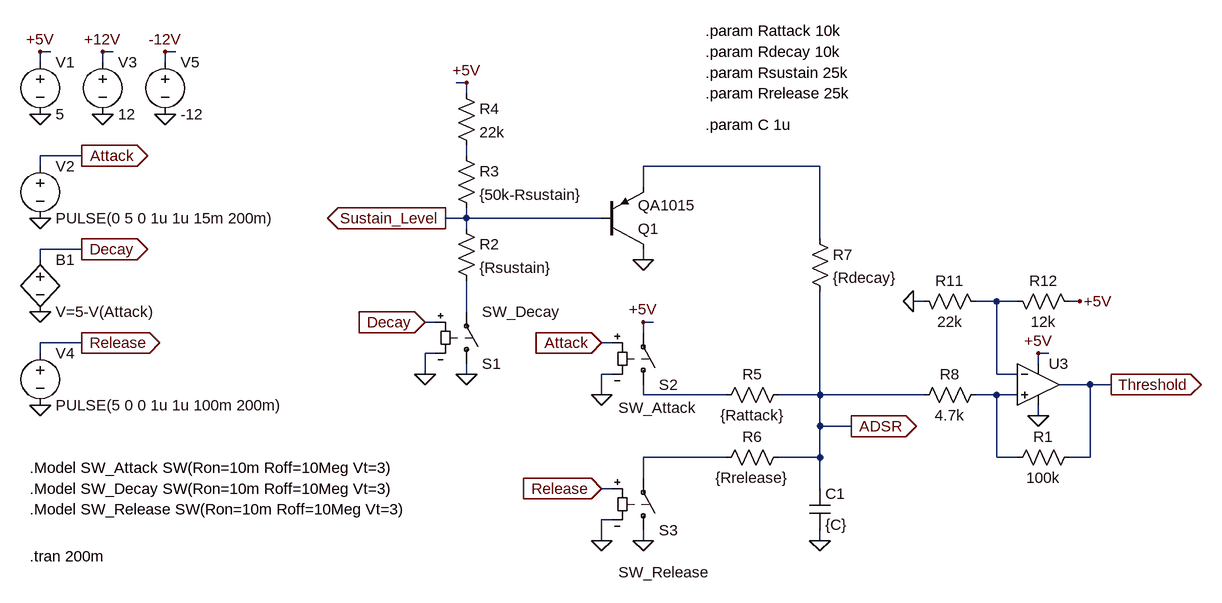
[diagram p0: schematic ADSR_SW+NonInv_Hys_Comparator.asc]
ADSR_SW+NonInv_Hys_Comparator.asc, the LTspice schematic file:
Version 4
SHEET 1 1660 760
WIRE -384 -336 -400 -336
WIRE -288 -336 -304 -336
WIRE -192 -336 -208 -336
WIRE -400 -320 -400 -336
WIRE -304 -320 -304 -336
WIRE -208 -320 -208 -336
WIRE 256 -288 240 -288
WIRE 256 -272 256 -288
WIRE -336 -176 -400 -176
WIRE 256 -176 256 -192
WIRE -400 -160 -400 -176
WIRE 800 -160 528 -160
WIRE 528 -128 528 -160
WIRE 256 -80 256 -96
WIRE 256 -80 224 -80
WIRE 464 -80 256 -80
WIRE 256 -64 256 -80
WIRE 800 -48 800 -160
WIRE -336 -32 -400 -32
WIRE -400 -16 -400 -32
WIRE 528 -16 528 -32
WIRE 960 48 944 48
WIRE 1072 48 1040 48
WIRE 1104 48 1072 48
WIRE 1200 48 1184 48
WIRE 256 64 256 16
WIRE 208 80 192 80
WIRE 544 80 528 80
WIRE 528 96 528 80
WIRE -336 112 -400 112
WIRE 480 112 464 112
WIRE -400 128 -400 112
WIRE 208 128 192 128
WIRE 1152 128 1136 128
WIRE 1136 144 1136 128
WIRE 192 160 192 128
WIRE 256 160 256 144
WIRE 480 160 464 160
WIRE 1072 160 1072 48
WIRE 1104 160 1072 160
WIRE 1216 176 1168 176
WIRE 1248 176 1216 176
WIRE 464 192 464 160
WIRE 528 192 528 176
WIRE 656 192 528 192
WIRE 800 192 800 32
WIRE 800 192 736 192
WIRE 960 192 800 192
WIRE 1072 192 1040 192
WIRE 1104 192 1072 192
WIRE 1136 224 1136 208
WIRE 800 240 800 192
WIRE 848 240 800 240
WIRE 656 288 528 288
WIRE 800 288 800 240
WIRE 800 288 736 288
WIRE 1072 288 1072 192
WIRE 1104 288 1072 288
WIRE 1216 288 1216 176
WIRE 1216 288 1184 288
WIRE 528 320 528 288
WIRE 480 336 464 336
WIRE 800 336 800 288
WIRE 480 384 464 384
WIRE 464 416 464 384
WIRE 528 416 528 400
WIRE 800 416 800 400
FLAG 192 80 Decay
IOPIN 192 80 In
FLAG 256 -288 +5V
FLAG 256 160 0
FLAG 528 -16 0
FLAG 464 112 Attack
IOPIN 464 112 In
FLAG 464 336 Release
IOPIN 464 336 In
FLAG 800 416 0
FLAG 1248 176 Threshold
IOPIN 1248 176 Out
FLAG -400 -336 +5V
FLAG -400 -240 0
FLAG -336 -176 Attack
IOPIN -336 -176 Out
FLAG -400 -80 0
FLAG -336 -32 Decay
IOPIN -336 -32 Out
FLAG -336 112 Release
IOPIN -336 112 Out
FLAG -400 208 0
FLAG -400 64 0
FLAG 224 -80 Sustain_Level
IOPIN 224 -80 Out
FLAG 192 160 0
FLAG 528 416 0
FLAG 464 416 0
FLAG 464 192 0
FLAG 528 80 +5V
FLAG -304 -240 0
FLAG -208 -240 0
FLAG -304 -336 +12V
FLAG -208 -336 -12V
FLAG 1136 224 0
FLAG 1200 48 +5V
FLAG 944 48 0
FLAG 1136 128 +5V
FLAG 848 240 ADSR
IOPIN 848 240 Out
SYMBOL res 240 -80 R0
SYMATTR InstName R2
SYMATTR Value {Rsustain}
SYMBOL res 240 -192 R0
SYMATTR InstName R3
SYMATTR Value {50k-Rsustain}
SYMBOL res 240 -288 R0
SYMATTR InstName R4
SYMATTR Value 22k
SYMBOL res 752 176 R90
WINDOW 0 0 56 VBottom 2
WINDOW 3 32 56 VTop 2
SYMATTR InstName R5
SYMATTR Value {Rattack}
SYMBOL res 752 272 R90
WINDOW 0 0 56 VBottom 2
WINDOW 3 32 56 VTop 2
SYMATTR InstName R6
SYMATTR Value {Rrelease}
SYMBOL res 784 -64 R0
SYMATTR InstName R7
SYMATTR Value {Rdecay}
SYMBOL cap 784 336 R0
SYMATTR InstName C1
SYMATTR Value {C}
SYMBOL voltage -400 -336 R0
WINDOW 123 0 0 Left 0
WINDOW 39 0 0 Left 0
SYMATTR InstName V1
SYMATTR Value 5
SYMBOL voltage -400 -176 R0
WINDOW 123 0 0 Left 0
WINDOW 39 0 0 Left 0
SYMATTR InstName V2
SYMATTR Value PULSE(0 5 0 1u 1u 15m 200m)
SYMBOL voltage -400 112 R0
WINDOW 123 0 0 Left 0
WINDOW 39 0 0 Left 0
SYMATTR InstName V4
SYMATTR Value PULSE(5 0 0 1u 1u 100m 200m)
SYMBOL pnp 464 -32 M180
SYMATTR InstName Q1
SYMATTR Value QA1015
SYMBOL bv -400 -32 R0
SYMATTR InstName B1
SYMATTR Value V=5-V(Attack)
SYMBOL sw 256 160 M180
SYMATTR InstName S1
SYMATTR Value SW_Decay
SYMBOL sw 528 192 M180
WINDOW 3 -38 -20 Left 2
SYMATTR Value SW_Attack
SYMATTR InstName S2
SYMBOL sw 528 416 M180
WINDOW 3 -38 -49 Left 2
SYMATTR Value SW_Release
SYMATTR InstName S3
SYMBOL voltage -304 -336 R0
WINDOW 123 0 0 Left 0
WINDOW 39 0 0 Left 0
SYMATTR InstName V3
SYMATTR Value 12
SYMBOL voltage -208 -336 R0
WINDOW 123 0 0 Left 0
WINDOW 39 0 0 Left 0
SYMATTR InstName V5
SYMATTR Value -12
SYMBOL Opamps\\UniversalOpamp2 1136 176 R0
SYMATTR InstName U3
SYMBOL res 944 32 M90
WINDOW 0 0 56 VBottom 2
WINDOW 3 32 56 VTop 2
SYMATTR InstName R11
SYMATTR Value 22k
SYMBOL res 1088 32 M90
WINDOW 0 0 56 VBottom 2
WINDOW 3 32 56 VTop 2
SYMATTR InstName R12
SYMATTR Value 12k
SYMBOL res 1200 272 R90
WINDOW 0 0 56 VBottom 2
WINDOW 3 32 56 VTop 2
SYMATTR InstName R1
SYMATTR Value 100k
SYMBOL res 1056 176 R90
WINDOW 0 0 56 VBottom 2
WINDOW 3 32 56 VTop 2
SYMATTR InstName R8
SYMATTR Value 4.7k
TEXT 624 -368 Left 2 !.param Rattack 10k
TEXT 624 -336 Left 2 !.param Rdecay 10k
TEXT 624 -304 Left 2 !.param Rsustain 25k
TEXT 624 -272 Left 2 !.param Rrelease 25k
TEXT -416 440 Left 2 !.tran 200m
TEXT 624 -224 Left 2 !.param C 1u
TEXT -416 304 Left 2 !.Model SW_Attack SW(Ron=10m Roff=10Meg Vt=3)
TEXT -416 336 Left 2 !.Model SW_Decay SW(Ron=10m Roff=10Meg Vt=3)
TEXT -416 368 Left 2 !.Model SW_Release SW(Ron=10m Roff=10Meg Vt=3)

The netlist it stands for:
* ADSR_SW+NonInv_Hys_Comparator.asc
R2 Sustain_Level N004 {Rsustain}
R3 N001 Sustain_Level {50k-Rsustain}
R4 +5V N001 22k
R5 ADSR N005 {Rattack}
R6 ADSR N007 {Rrelease}
R7 N002 ADSR {Rdecay}
C1 ADSR 0 {C}
V1 +5V 0 5
V2 Attack 0 PULSE(0 5 0 1u 1u 15m 200m)
V4 Release 0 PULSE(5 0 0 1u 1u 100m 200m)
Q1 0 Sustain_Level N002 0 QA1015
B1 Decay 0 V=5-V(Attack)
S1 0 N004 Decay 0 SW_Decay
S2 N005 +5V Attack 0 SW_Attack
S3 0 N007 Release 0 SW_Release
V3 +12V 0 12
V5 -12V 0 -12
XU3 N006 N003 +5V 0 Threshold level.2 Avol=1Meg GBW=10Meg Slew=10Meg ilimit=25m rail=0 Vos=0 phimargin=45 en=0 enk=0 in=0 ink=0 Rin=500Meg  ; pins IN+ IN- V+ V- OUT
R11 0 N003 22k
R12 N003 +5V 12k
R1 Threshold N006 100k
R8 N006 ADSR 4.7k
.model NPN NPN
.model PNP PNP
.lib standard.bjt
.param Rattack 10k
.param Rdecay 10k
.param Rsustain 25k
.param Rrelease 25k
.tran 200m
.param C 1u
.Model SW_Attack SW(Ron=10m Roff=10Meg Vt=3)
.Model SW_Decay SW(Ron=10m Roff=10Meg Vt=3)
.Model SW_Release SW(Ron=10m Roff=10Meg Vt=3)
.lib UniversalOpamps2.sub
.backanno
.end